# EAGLE schematic midicontrol_v2 (EAGLE 9.4.0)
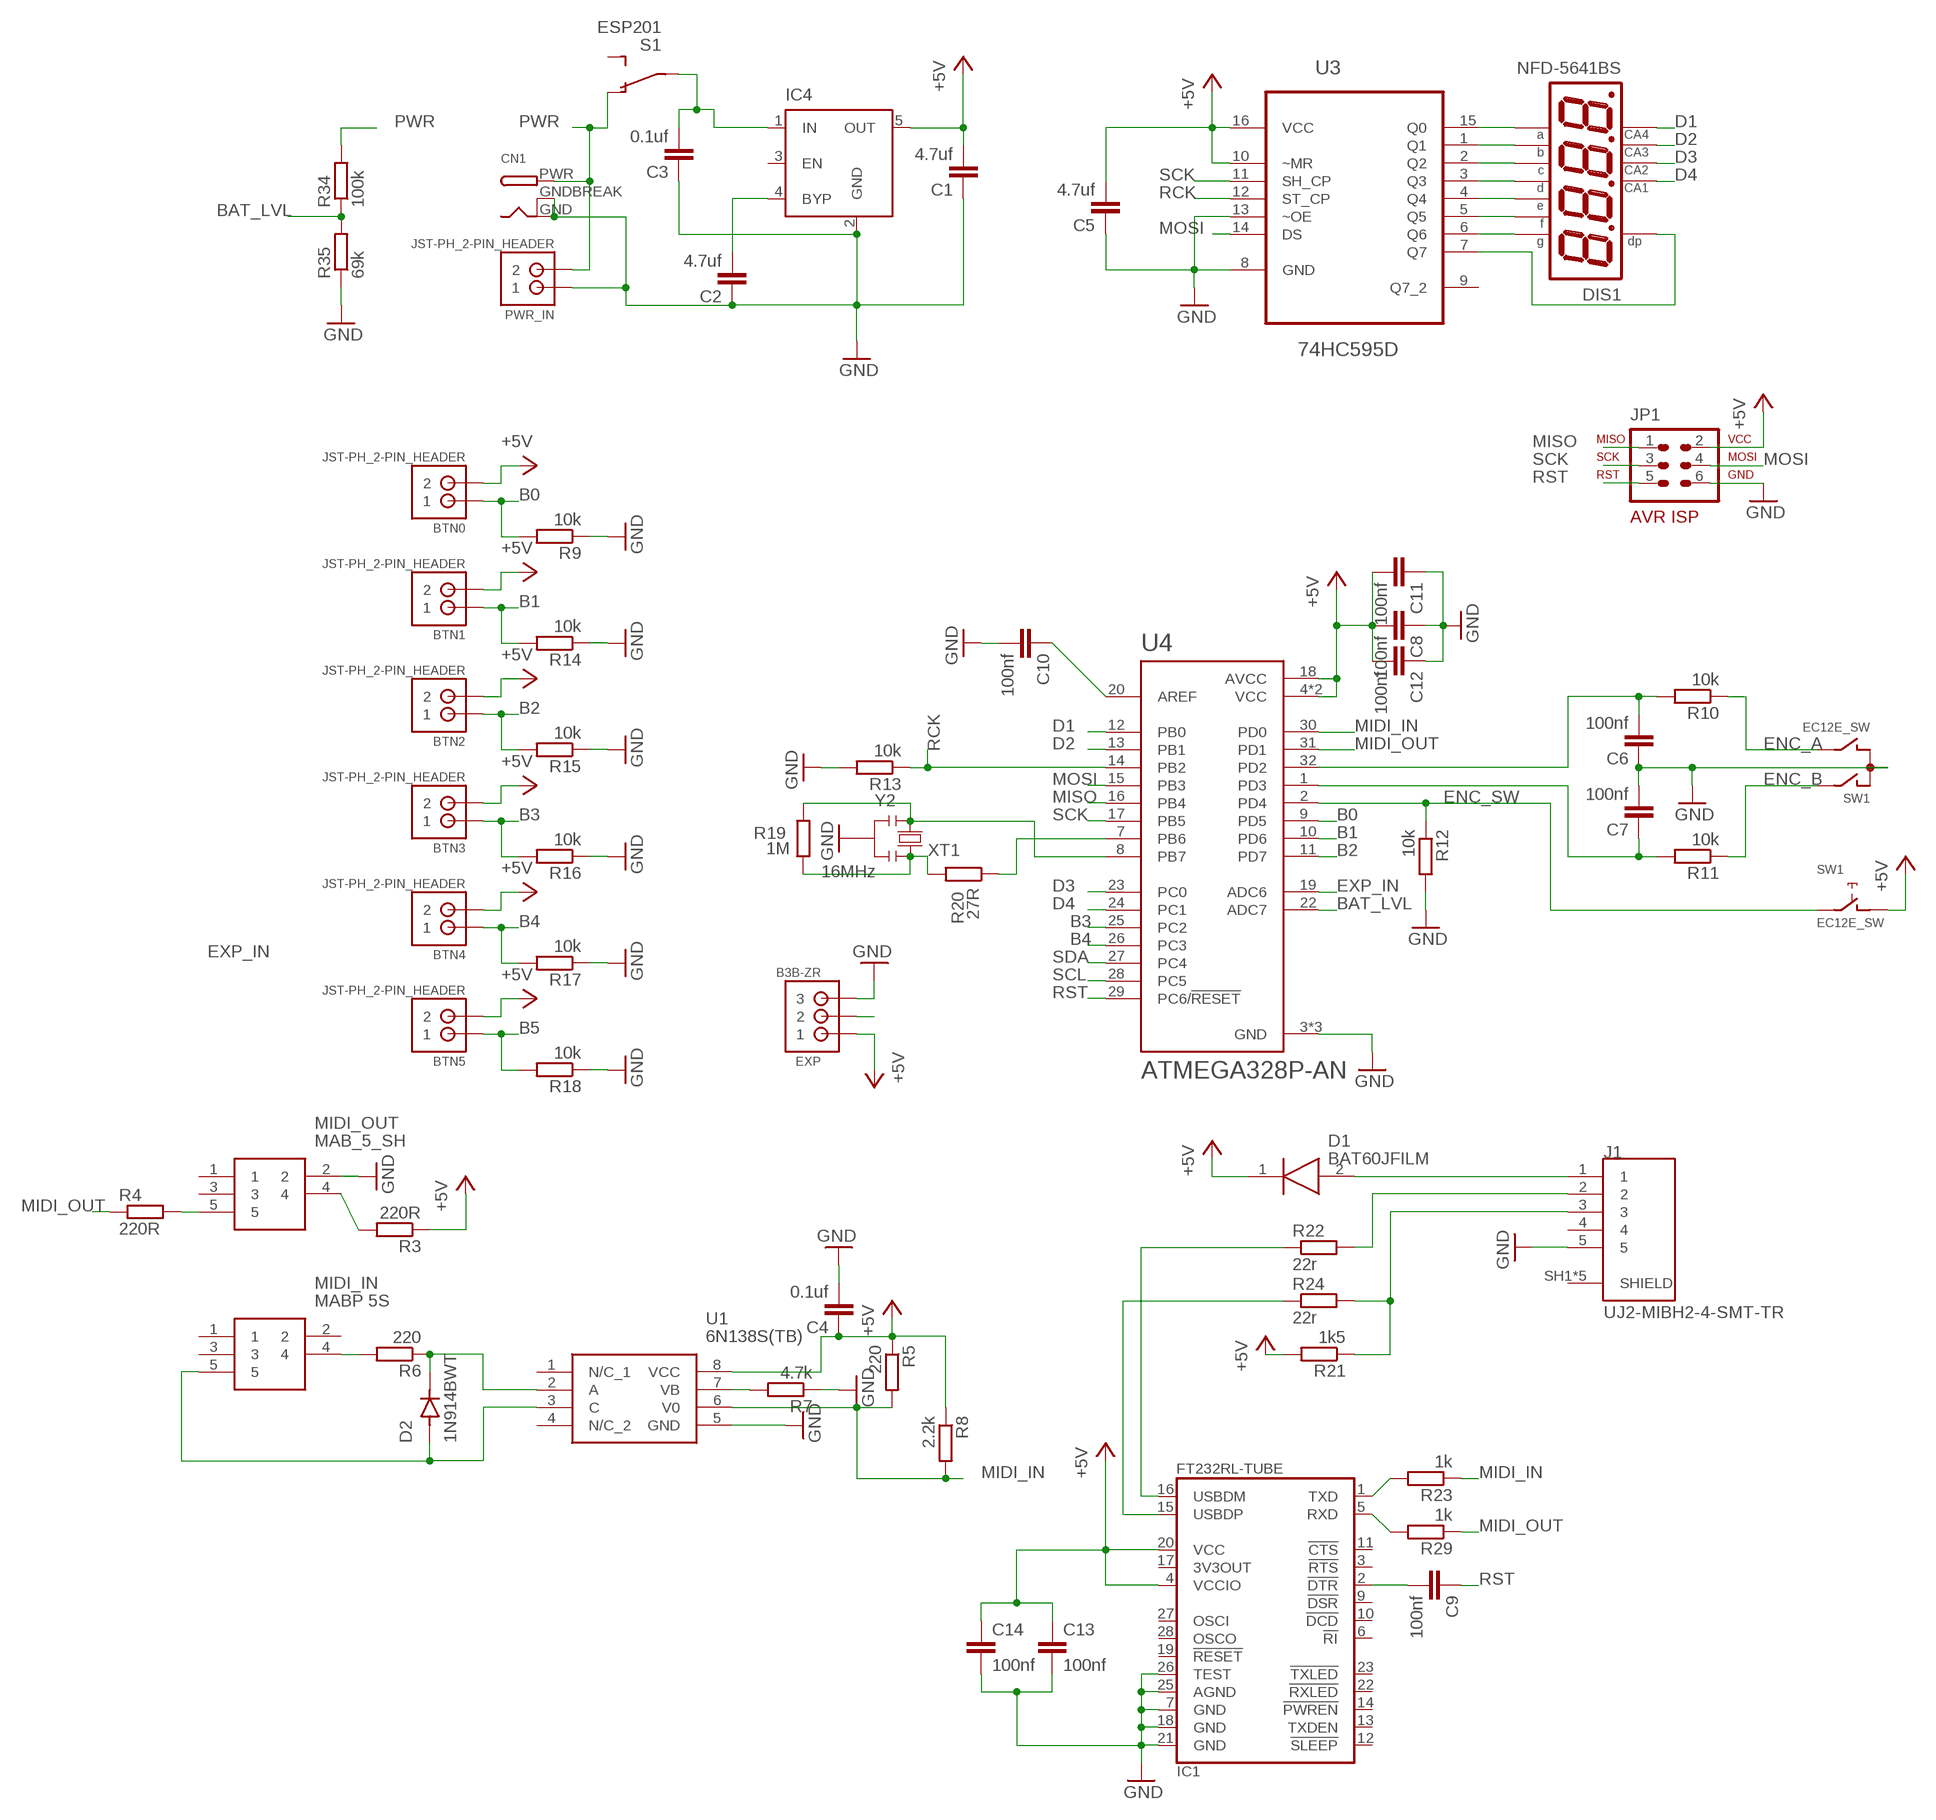
[diagram p0: schematic, sheet 1]

## Parts
BTN0  JST-PH_2-PIN_HEADER  [JST_B2B-PH_HEADER]
BTN1  JST-PH_2-PIN_HEADER  [JST_B2B-PH_HEADER]
BTN2  JST-PH_2-PIN_HEADER  [JST_B2B-PH_HEADER]
BTN3  JST-PH_2-PIN_HEADER  [JST_B2B-PH_HEADER]
BTN4  JST-PH_2-PIN_HEADER  [JST_B2B-PH_HEADER]
BTN5  JST-PH_2-PIN_HEADER  [JST_B2B-PH_HEADER]
C1  4.7uf  C-EUC1206  [C1206]
C2  4.7uf  C-EUC1206  [C1206]
C3  0.1uf  C-EUC1206  [C1206]
C4  0.1uf  C-EUC0603  [C0603]
C5  4.7uf  C-EUC0603  [C0603]
C6  100nf  C-EUC0603  [C0603]
C7  100nf  C-EUC0603  [C0603]
C8  100nf  C-EUC0603  [C0603]
C9  100nf  C-EUC0603  [C0603]
C10  100nf  C-EUC0603  [C0603]
C11  100nf  C-EUC0603  [C0603]
C12  100nf  C-EUC0603  [C0603]
C13  100nf  C-EUC0603  [C0603]
C14  100nf  C-EUC0603  [C0603]
CN1  DCBARRELPTH  [DCJACK_2MM_PTH]
D1  BAT60JFILM  [SOD2513X117N]
D2  1N914BWT  [SODFL1608X70N]
DIS1  NFD-5641BS  [NFD-5641]
EXP  B3B-ZR  [B3B-ZR]
IC1  FT232RL-TUBE  [SSOP28-LD]
IC4  MIC5219XX  [SOT23-5]
J1  UJ2-MIBH2-4-SMT-TR  [CUI_UJ2-MIBH2-4-SMT-TR]
JP1  AVR-ISP-6HORZ  [AVR-ISP-6R]
MIDI_IN  MABP 5S  MAB_5_SH  [MAB-5-SH]
MIDI_OUT  MAB_5_SH  [MAB-5-SH]
PWR_IN  JST-PH_2-PIN_HEADER  [JST_B2B-PH_HEADER]
R3  220R  R-EU_R0603  [R0603]
R4  220R  R-EU_R0603  [R0603]
R5  220  R-EU_R0603  [R0603]
R6  220  R-EU_R0603  [R0603]
R7  4.7k  R-EU_R0603  [R0603]
R8  2.2k  R-EU_R0603  [R0603]
R9  10k  R-EU_R0603  [R0603]
R10  10k  R-EU_R0603  [R0603]
R11  10k  R-EU_R0603  [R0603]
R12  10k  R-EU_R0603  [R0603]
R13  10k  R-EU_R0603  [R0603]
R14  10k  R-EU_R0603  [R0603]
R15  10k  R-EU_R0603  [R0603]
R16  10k  R-EU_R0603  [R0603]
R17  10k  R-EU_R0603  [R0603]
R18  10k  R-EU_R0603  [R0603]
R19  1M  R-EU_R0603  [R0603-ROUND]
R20  27R  R-EU_R0603  [R0603-ROUND]
R21  1k5  R-EU_R0603  [R0603]
R22  22r  R-EU_R0603  [R0603]
R23  1k  R-EU_R0603  [R0603]
R24  22r  R-EU_R0603  [R0603]
R29  1k  R-EU_R0603  [R0603]
R34  100k  R-EU_R0603  [R0603]
R35  69k  R-EU_R0603  [R0603]
S1  ESP201  [ESP201]
SW1  EC12E_SW  [ALPS_EC12E_SW]
U1  6N138S(TB)  [SOP254P1030X460-8N]
U3  74HC595D  [SOIC127P600X175-16N]
U4  ATMEGA328P-AN  [QFP80P900X900X120-32N]
Y2  16MHz  RESONATORMU  [RESONATOR]

## Nets
+5V: BTN0.P2 BTN1.P2 BTN2.P2 BTN3.P2 BTN4.P2 BTN5.P2 C1.2 C4.1 C5.2 C8.2 C11.2 C12.2 C13.1 C14.1 D1.1(K) EXP.1 IC1.4(VCCIO) IC1.20(VCC) IC4.5(OUT) JP1.2 R3.1 R5.1 R8.1 R21.2 SW1.D U1.8(VCC) U3.10(~MR) U3.16(VCC) U4.4(VCC) U4.6(VCC) U4.18(AVCC)
B0: BTN0.P1 R9.2 U4.9(PD5)
B1: BTN1.P1 R14.2 U4.10(PD6)
B2: BTN2.P1 R15.2 U4.11(PD7)
B3: BTN3.P1 R16.2 U4.25(PC2)
B4: BTN4.P1 R17.2 U4.26(PC3)
B5: BTN5.P1 R18.2
BAT_LVL: R34.1 R35.2 U4.22(ADC7)
D1: DIS1.P$6 U4.12(PB0)
D2: DIS1.P$8 U4.13(PB1)
D3: DIS1.P$9 U4.23(PC0)
D4: DIS1.P$12 U4.24(PC1)
ENC_A: R10.1 SW1.B
ENC_B: R11.1 SW1.A
ENC_SW: R12.1 SW1.E U4.2(PD4)
EXP_IN: EXP.2 U4.19(ADC6)
GND: C1.1 C2.1 C3.1 C4.2 C5.1 C6.1 C7.2 C8.1 C10.2 C11.1 C12.1 C13.2 C14.2 CN1.GND CN1.GNDBREAK EXP.3 IC1.7(GND) IC1.18(GND) IC1.21(GND) IC1.25(AGND) IC1.26(TEST) IC4.2(GND) J1.5 JP1.6 MIDI_OUT.2 PWR_IN.P1 R7.1 R9.1 R12.2 R13.2 R14.1 R15.1 R16.1 R17.1 R18.1 R35.1 SW1.C U1.5(GND) U3.8(GND) U3.13(~OE) U4.3(GND) U4.5(GND) U4.21(GND) Y2.2
MIDI_IN: R5.2 R8.2 R23.1 U1.6(V0) U4.30(PD0)
MIDI_OUT: R4.1 R29.1 U4.31(PD1)
MISO: JP1.1 U4.16(PB4)
MOSI: JP1.4 U3.14(DS) U4.15(PB3)
N$1: DIS1.P$11 U3.15(Q0)
N$2: DIS1.P$7 U3.1(Q1)
N$3: DIS1.P$4 U3.2(Q2)
N$4: DIS1.P$2 U3.3(Q3)
N$5: DIS1.P$1 U3.4(Q4)
N$6: DIS1.P$10 U3.5(Q5)
N$7: DIS1.P$5 U3.6(Q6)
N$8: DIS1.P$3 U3.7(Q7)
N$9: MIDI_OUT.4 R3.2
N$10: MIDI_OUT.5 R4.2
N$11: D2.A MIDI_IN.5 U1.3(C)
N$12: D2.C(K) R6.1 U1.2(A)
N$13: MIDI_IN.4 R6.2
N$14: R7.2 U1.7(VB)
N$15: C6.2 R10.2 U4.32(PD2)
N$16: R20.1 U4.7(PB6)
N$17: C7.1 R11.2 U4.1(PD3)
N$19: IC1.1(TXD) R23.2
N$20: C2.2 IC4.4(BYP)
N$21: C10.1 U4.20(AREF)
N$25: IC1.5(RXD) R29.2
N$26: C3.2 IC4.1(IN) S1.P$1(P)
N$28: J1.3 R21.1 R24.2
N$29: C9.2 IC1.2(!DTR)
N$30: D1.2(A) J1.1
N$34: J1.2 R22.2
N$38: IC1.16(USBDM) R22.1
N$39: IC1.15(USBDP) R24.1
PWR: CN1.PWR PWR_IN.P2 R34.2 S1.P$3(O)
RCK: R13.1 U3.12(ST_CP) U4.14(PB2)
RST: C9.1 JP1.5 U4.29(PC6/!RESET)
SCK: JP1.3 U3.11(SH_CP) U4.17(PB5)
SCL: U4.28(PC5)
SDA: U4.27(PC4)
XT1: R19.1 R20.2 Y2.3
XTAL2: R19.2 U4.8(PB7) Y2.1
Unconnected: IC1.3(!RTS) IC1.6(!RI) IC1.9(!DSR) IC1.10(!DCD) IC1.11(!CTS) IC1.12(!SLEEP) IC1.13(TXDEN) IC1.14(!PWREN) IC1.19(!RESET) IC1.22(!RXLED) IC1.23(!TXLED) IC1.27(OSCI) IC1.28(OSCO) IC4.3(EN) J1.4 J1.SH1(SHIELD) J1.SH2(SHIELD) J1.SH3(SHIELD) J1.SH4(SHIELD) J1.SH5(SHIELD) MIDI_IN.1 MIDI_IN.2 MIDI_IN.3 MIDI_OUT.1 MIDI_OUT.3 S1.P$2(S) SW1.GND1(G) SW1.GND2(G) U1.1(N/C_1) U1.4(N/C_2) U3.9(Q7_2)

## Power pins joined to a net without a drawn wire
3V3OUT: IC1.17(3V3OUT)

## Library data of the parts
BTN0 BTN1-BTN5 PWR_IN = srg:JST-PH_2-PIN_HEADER: 2-pin JST PH Shrouded Header, top entry P/N B2B-PH-K-S Mating connector PHR-2 Mating cable assembly: Sparkfun PRT-09914 <http://www.sparkfun.com/products/9914>
C1-C14 = rcl:C-EU: CAPACITOR, European symbol; SPICEPREFIX: C
CN1 = adafruit:DCBARREL: 2.0mm DC Barrel Jack DCJACK_2MM_PTH - Through Hole Jack (4UConnector: 05537)
D1 = BAT60JFILM:BAT60JFILM: BAT60JFILM, Schottky Diode, 3A max, 10V, 2-Pin, SOD-323 Source: Datasheet <http://www.st.com/web/en/resource/technical/document/datasheet/CD00001944.pdf>; ALLIED_NUMBER: 70389806; ALLIED_PRICE-STOCK: http://www.alliedelec.com/stmicroelectronics-bat60jfilm/70389806/; DESCRIPTION: BAT60JFILM, Schottky Diode, 3A max, 10V, 2-Pin, SOD-323; HEIGHT: 1.17mm; MANUFACTURER_NAME: STMicroelectronics; MANUFACTURER_PART_NUMBER: BAT60JFILM; MOUSER_PART_NUMBER: 511-BAT60JFILM; MOUSER_PRICE-STOCK: https://www.mouser.com/Search/Refine.aspx?Keyword=511-BAT60JFILM; RS_PART_NUMBER: 1458781; RS_PRICE-STOCK: http://uk.rs-online.com/web/p/products/1458781
D2 = 1N914BWT:1N914BWT: 1N914B Series 75 V 300 mA Surface Mount Small Signal Diode - SOD-523F; AVAILABILITY: Unavailable; DESCRIPTION: 1N914B Series 75 V 300 mA Surface Mount Small Signal Diode - SOD-523F; MF: ON Semiconductor; MP: 1N914BWT; PACKAGE: SOD-523F ON Semiconductor; PRICE: None
DIS1 = display-misc:NFD-5641BS: Four Digit 0.56" CA Seven-Segment LED Display Futurlec part number: 7FR5641BS Created by RobG
EXP = jst:B3B-ZR: JST-ZH Connector 3 pol, 1.5mm pitch Package: B3B-ZR Source: http://www.jst-mfg.com/product/pdf/eng/eZH.pdf
IC1 = FT232RL-TUBE:FT232RL-TUBE; AVAILABILITY: Unavailable; DESCRIPTION: USB-to-UART 1-CH 256byte FIFO 5V 28-Pin SSOP Tube; MF: FTDI,; MP: FT232RL-TUBE; PACKAGE: SSOP-28 FTDI; PRICE: None
IC4 = v-reg-micrel:MIC5219XX: VOLTAGE REGULATOR; OC_FARNELL: unknown; OC_NEWARK: unknown
J1 = UJ2-MIBH2-4-SMT-TR:UJ2-MIBH2-4-SMT-TR: Micro B Type 5 Pin Horizontal 30 µin Plating SMT USB Jack 2.0; AVAILABILITY: Unavailable; CUI_PURCHASE_URL: https://www.cui.com/product/interconnect/usb-connectors/micro-b/uj2-mibh2-4-smt?utm_source=snapeda.com&utm_medium=referral&utm_campaign=snapedaBOM; DESCRIPTION: Micro B Type 5 Pin Horizontal 30 µin Plating SMT USB Jack 2.0; MF: CUI Inc.; MP: UJ2-MIBH2-4-SMT-TR; PACKAGE: None; PRICE: None
JP1 = avr-7:AVR-ISP-6: AVR ISP-6 Serial Programming Header
MIDI_IN MIDI_OUT = MAB_5_SH:MAB_5_SH: HIRSCHMANN - MAB 5 SH - SOCKET, DIN, PCB, 5PIN Source: Datasheet <http://www.farnell.com/datasheets/1599432.pdf>; DESCRIPTION: HIRSCHMANN - MAB 5 SH - SOCKET, DIN, PCB, 5PIN; HEIGHT: mm; MANUFACTURER_NAME: Hirschmann; MANUFACTURER_PART_NUMBER: MAB 5 SH
R3-R18 R21-R24 R29 R34 R35 = rcl:R-EU_: RESISTOR, European symbol; SPICEPREFIX: R
R19 R20 = SmartPrj:R-EU_: RESISTOR, European symbol
S1 = olli:ESP201: Switch ESP201 available at reichelt.de
SW1 = switch-alps:EC12E_SW: ALPS rotary Encoder EC12E series with switch; MPN: EC12E2424407; OC_FARNELL: 1520813; OC_NEWARK: 74M1068
U1 = 6N138S(TB):6N138S(TB): High Speed Optocouplers Low Input, High Gain DC Input Source: Datasheet <https://componentsearchengine.com/Datasheets/1/6N138S(TB).pdf>; DESCRIPTION: High Speed Optocouplers Low Input, High Gain DC Input; HEIGHT: 4.6mm; MANUFACTURER_NAME: Everlight; MANUFACTURER_PART_NUMBER: 6N138S(TB); MOUSER_PART_NUMBER: 638-6N138STB; MOUSER_PRICE-STOCK: https://www.mouser.com/Search/Refine.aspx?Keyword=638-6N138STB
U3 = 74HC595D:74HC595D: 8-bit serial-in parallel-out shift register; AVAILABILITY: Unavailable; DESCRIPTION: Shift Register Single 8-Bit Serial to Serial/Parallel 16-Pin SO; MF: Toshiba Semiconductor; MP: 74HC595D; PACKAGE: SO-16 NXP Semiconductors; PRICE: None
U4 = ATMEGA328P-AN:ATMEGA328P-AN: ATmega Series 20 MHz 32 KB Flash 2 KB SRAM 8-Bit Microcontroller - TQFP-32; AVAILABILITY: Unavailable; DESCRIPTION: MCU 8-bit ATmega AVR RISC 32KB Flash 2.5V/3.3V/5V 32-Pin TQFP Tray; MF: Microchip; MP: ATMEGA328P-AN; PACKAGE: TQFP-32 Microchip; PRICE: None
Y2 = SmartPrj:RESONATOR

## Net classes
0 default: clearance 0.152 mm